# EAGLE design FANET_RPiZero (EAGLE 7.7.0)
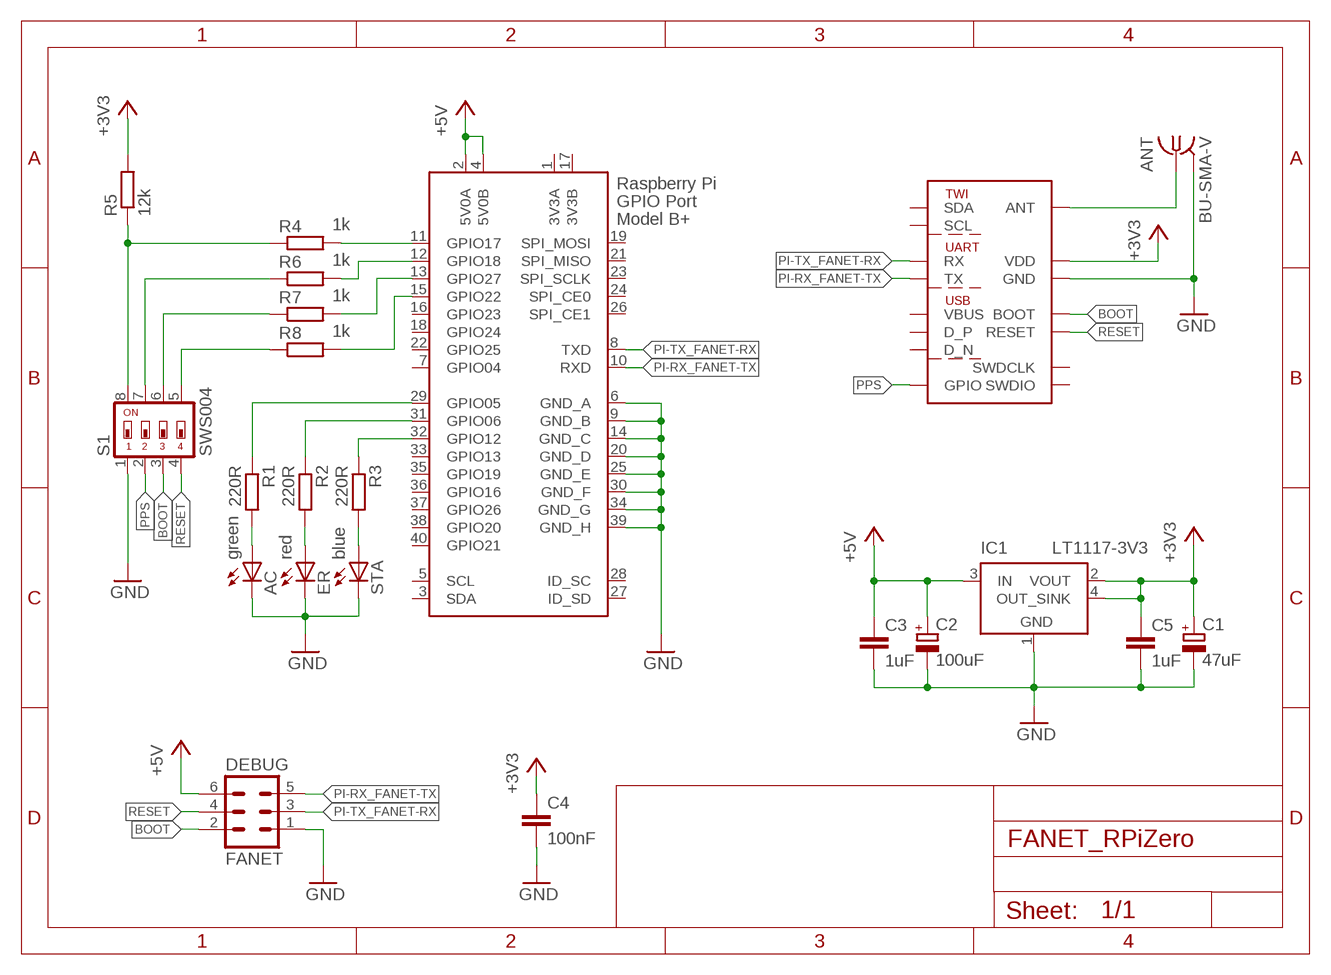
[diagram p0: schematic, sheet 1]

## Parts
AC  green  LEDCHIP-LED0805  [CHIP-LED0805]
ANT  BU-SMA-V  [BU-SMA-V]
C1  47uF  CPOL-EUSMCC  [SMC_C]
C2  100uF  CPOL-EUSMCC  [SMC_C]
C3  1uF  C-EUC1206  [C1206]
C4  100nF  C-EUC1206  [C1206]
C5  1uF  C-EUC1206  [C1206]
DEBUG  FANET  ML6  [ML6]
ER  red  LEDCHIP-LED0805  [CHIP-LED0805]
FANET_MODULE  FANET_MODULE  [FANET_INTERNAL]
IC1  LT1117-3V3  LT1117  [SOT223]
R1  220R  R-EU_R0805  [R0805]
R2  220R  R-EU_R0805  [R0805]
R3  220R  R-EU_R0805  [R0805]
R4  1k  R-EU_R0805  [R0805]
R5  12k  R-EU_R0805  [R0805]
R6  1k  R-EU_R0805  [R0805]
R7  1k  R-EU_R0805  [R0805]
R8  1k  R-EU_R0805  [R0805]
RASPI_ZERO  RASPI_GPIO_B+#  [RASPI_BOARD_ZERO_FULL_PAD]
S1  SWS004  [SMS-004]
STA  blue  LEDCHIP-LED0805  [CHIP-LED0805]

## Nets
+3V3: C1.+ C4.1 C5.1 FANET_MODULE.VSS(VDD) IC1.2(VOUT) IC1.4(OUT_SINK) R5.2
+5V: C2.+ C3.1 DEBUG.6 IC1.3(IN) RASPI_ZERO.2(5V0A) RASPI_ZERO.4(5V0B)
BOOT: DEBUG.2 FANET_MODULE.BOOT S1.3
GND: AC.C ANT.2 ANT.3 ANT.4 ANT.5 C1.- C2.- C3.2 C4.2 C5.2 DEBUG.1 ER.C FANET_MODULE.GND0(GND) FANET_MODULE.GND1(GND) IC1.1(GND) RASPI_ZERO.6(GND_A) RASPI_ZERO.9(GND_B) RASPI_ZERO.14(GND_C) RASPI_ZERO.20(GND_D) RASPI_ZERO.25(GND_E) RASPI_ZERO.30(GND_F) RASPI_ZERO.34(GND_G) RASPI_ZERO.39(GND_H) S1.1 STA.C
N$1: ANT.1 FANET_MODULE.ANT
N$2: R4.2 RASPI_ZERO.11(GPIO17)
N$4: R4.1 R5.1 S1.8
N$5: R6.1 S1.7
N$6: R6.2 RASPI_ZERO.12(GPIO18)
N$7: R7.2 RASPI_ZERO.13(GPIO27)
N$8: R8.2 RASPI_ZERO.15(GPIO22)
N$9: R7.1 S1.6
N$10: R8.1 S1.5
N$11: AC.A R1.2
N$12: ER.A R2.2
N$13: R3.2 STA.A
N$14: R3.1 RASPI_ZERO.32(GPIO12)
N$15: R2.1 RASPI_ZERO.31(GPIO06)
N$16: R1.1 RASPI_ZERO.29(GPIO05)
PI-RX_FANET-TX: DEBUG.5 FANET_MODULE.TX RASPI_ZERO.10(RXD)
PI-TX_FANET-RX: DEBUG.3 FANET_MODULE.RX RASPI_ZERO.8(TXD)
PPS: FANET_MODULE.GPIO0(GPIO) S1.2
RESET: DEBUG.4 FANET_MODULE.RESET S1.4
Unconnected: FANET_MODULE.D_N FANET_MODULE.D_P FANET_MODULE.SCL FANET_MODULE.SDA FANET_MODULE.SWDCLK FANET_MODULE.SWDIO FANET_MODULE.VBUS RASPI_ZERO.3(SDA) RASPI_ZERO.5(SCL) RASPI_ZERO.7(GPIO04) RASPI_ZERO.16(GPIO23) RASPI_ZERO.18(GPIO24) RASPI_ZERO.19(SPI_MOSI) RASPI_ZERO.21(SPI_MISO) RASPI_ZERO.22(GPIO25) RASPI_ZERO.23(SPI_SCLK) RASPI_ZERO.24(SPI_CE0) RASPI_ZERO.26(SPI_CE1) RASPI_ZERO.27(ID_SD) RASPI_ZERO.28(ID_SC) RASPI_ZERO.33(GPIO13) RASPI_ZERO.35(GPIO19) RASPI_ZERO.36(GPIO16) RASPI_ZERO.37(GPIO26) RASPI_ZERO.38(GPIO20) RASPI_ZERO.40(GPIO21)

## Power pins joined to a net without a drawn wire
3V3A: RASPI_ZERO.1(3V3A)
3V3B: RASPI_ZERO.17(3V3B)

## Library data of the parts
AC ER STA = led:LED: LED OSRAM: - CHIPLED LG R971, LG N971, LY N971, LG Q971, LY Q971, LO R971, LY R971 LH N974, LH R974 LS Q976, LO Q976, LY Q976 LO Q996 - Hyper CHIPLED LW Q18S LB Q993, LB Q99A, LB R99A - SideLED LS A670, LO A670, LY A670, LG A670, LP A670 LB A673, LV A673, LT A673, LW A673 LH A674 LY A675 LS A676, LA A676, LO A676, LY A676, LW A676 LS A679, LY A679, LG A679 - Hyper Micro SIDELED® LS Y876, LA Y876, LO Y876, LY Y876 LT Y87S - SmartLED LW L88C, LW L88S LB L89C, LB L89S, LG L890 LS L89K, LO L89K, LY L89K LS L896, LA L896, LO L896, LY L896 - TOPLED LS T670, LO T670, LY T670, LG T670, LP T670 LSG T670, LSP T670, LSY T670, LOP T670, LYG T670 LG T671, LOG T671, LSG T671 LB T673, LV T673, LT T673, LW T673 LH T674 LS T676, LA T676, LO T676, LY T676, LB T676, LH T676, LSB T676, LW T676 LB T67C, LV T67C, LT T67C, LS T67K, LO T67K, LY T67K, LW E67C LS E67B, LA E67B, LO E67B, LY E67B, LB E67C, LV E67C, LT E67C LW T67C LS T679, LY T679, LG T679 LS T770, LO T770, LY T770, LG T770, LP T770 LB T773, LV T773, LT T773, LW T773 LH T774 LS E675, LA E675, LY E675, LS T675 LS T776, LA T776, LO T776, LY T776, LB T776 LHGB T686 LT T68C, LB T68C - Hyper Mini TOPLED® LB M676 - Mini TOPLED Santana® LG M470 LS M47K, LO M47K, LY M47K Source: http://www.osram.convergy.de LUXEON: - LUMILED® LXK2-PW12-R00, LXK2-PW12-S00, LXK2-PW14-U00, LXK2-PW14-V00 LXK2-PM12-R00, LXK2-PM12-S00, LXK2-PM14-U00 LXK2-PE12-Q00, LXK2-PE12-R00, LXK2-PE12-S00, LXK2-PE14-T00, LXK2-PE14-U00 LXK2-PB12-K00, LXK2-PB12-L00, LXK2-PB12-M00, LXK2-PB14-N00, LXK2-PB14-P00, LXK2-PB14-Q00 LXK2-PR12-L00, LXK2-PR12-M00, LXK2-PR14-Q00, LXK2-PR14-R00 LXK2-PD12-Q00, LXK2-PD12-R00, LXK2-PD12-S00 LXK2-PH12-R00, LXK2-PH12-S00 LXK2-PL12-P00, LXK2-PL12-Q00, LXK2-PL12-R00 Source: www.luxeon.com KINGBRIGHT: KA-3528ASYC Source: www.kingbright.com
ANT = con-coax:BU-SMA-V: FEMALE SMA CONNECTOR Radiall distributor RS 112-3794; OC_FARNELL: unknown; OC_NEWARK: unknown
C1 C2 = rcl:CPOL-EU: POLARIZED CAPACITOR, European symbol
C3-C5 = rcl:C-EU: CAPACITOR, European symbol
DEBUG = con-harting-ml:ML6: HARTING; OC_FARNELL: unknown; OC_NEWARK: unknown
FANET_MODULE = fanet:FANET_MODULE
IC1 = mylib:LT1117: VOLTAGE REGULATOR with shutdown; MPN: LT1117
R1-R8 = rcl:R-EU_: RESISTOR, European symbol
RASPI_ZERO = raspberrypi_b+_zero:RASPI_GPIO_B+#: 2x20 header connector, all pins connected
S1 = smd-special:SWS004: SMD Dip Switch 4 pol.

## Board
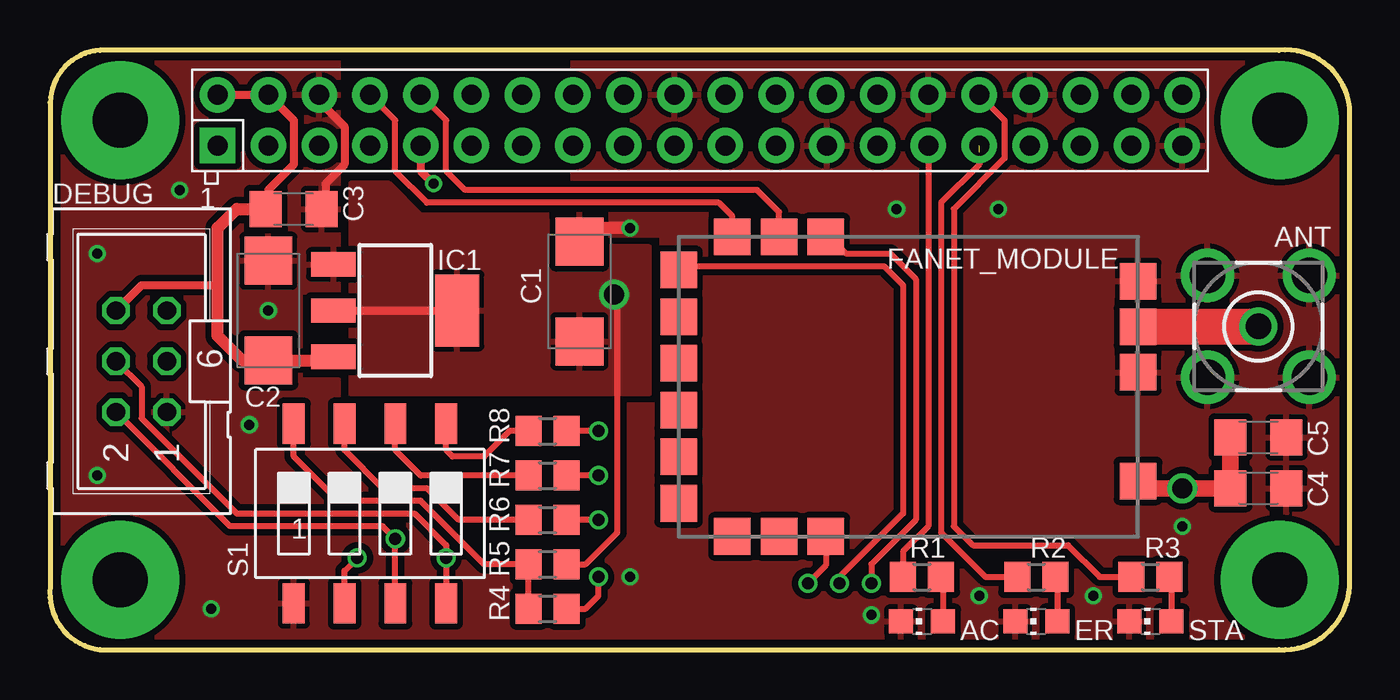
[diagram p1: board, top side]
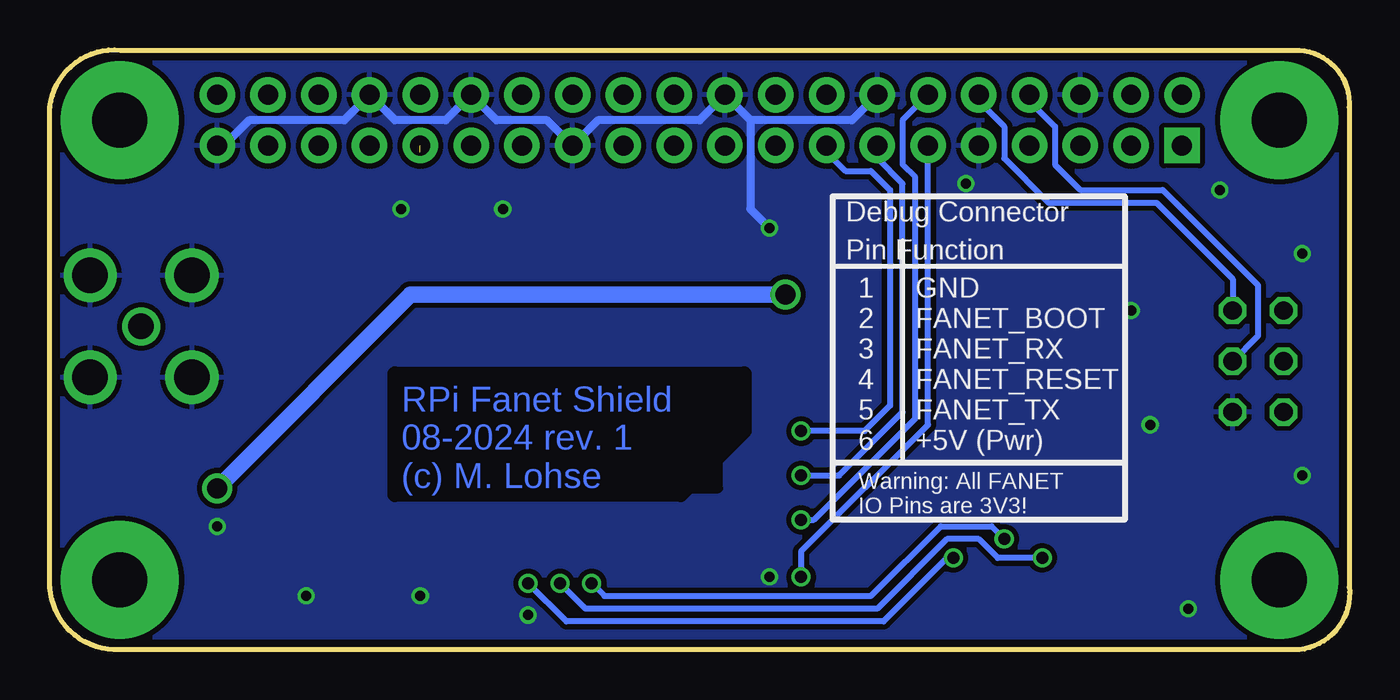
[diagram p2: board, bottom side, seen from below]

Size 65.02 x 30.02 mm. Coordinates in mm from the lower left corner, seen from the top.
Copper layers (1*16): Top 0.0356mm / dielectric 1.5011mm / Bottom 0.0356mm
Design rules "LaenPCBOrder": minimum track width 6mil, minimum drill 13mil, track to track 6mil, track to pad 6mil, pad to pad 6mil, via to via 6mil, smd to smd 6mil, copper to edge 15mil, drill to drill 6mil, minimum pad ring 7mil, minimum via ring 7mil, stop-mask expansion 3mil, vias tented up to drill 0mil, thermal gap 10mil
bRestrict: 5 lines

### Footprints (pad centres in the part's own frame; a part is rotated, then mirrored left to right if it is on the bottom)
CHIP-LED0805 = smd 1.2 x 1.2: A 0,-1.05; C 0,1.05
BU-SMA-V = drill 1.27: 1 0,0 | drill 1.778: 2 -2.55,2.55; 3 2.55,2.55; 4 2.55,-2.55; 5 -2.55,-2.55
SMC_C = smd 2.4 x 2.4: + -2.5,0; - 2.5,0
C1206 = smd 1.6 x 1.8: 1 -1.4,0; 2 1.4,0
ML6 = drill 0.914 octagon: 1 -2.54,-1.27; 2 -2.54,1.27; 3 0,-1.27; 4 0,1.27; 5 2.54,-1.27; 6 2.54,1.27
FANET_INTERNAL = smd 1.829 x 1.829: ANT -2.997,14.3; BOOT 7.493,-1.321; D_N -3.505,-8.687; D_P -1.168,-8.687; GND0 -5.283,14.3; GND1 -0.711,14.3; GPIO0 -5.842,-8.687; RESET -7.493,-1.321; RX -7.493,-5.994; SCL 7.493,-5.994; SDA 7.493,-3.658; SWDCLK 3.505,-8.687; SWDIO 1.168,-8.687; TX -7.493,-3.658; VBUS 5.842,-8.687; VSS 4.724,14.3
SOT223 = smd 1.219 x 2.235: 1 -2.311,-3.099; 2 0,-3.099; 3 2.311,-3.099 | smd 3.6 x 2.2: 4 0,3.099
R0805 = smd 1.3 x 1.5: 1 -0.95,0; 2 0.95,0
RASPI_BOARD_ZERO_FULL_PAD = drill 1 pad 1.778 square: 1 8.89,25.4 | drill 1 pad 1.778: 2 8.89,27.94; 3 11.43,25.4; 4 11.43,27.94; 5 13.97,25.4; 6 13.97,27.94; 7 16.51,25.4; 8 16.51,27.94; 9 19.05,25.4; 10 19.05,27.94; 11 21.59,25.4; 12 21.59,27.94; 13 24.13,25.4; 14 24.13,27.94; 15 26.67,25.4; 16 26.67,27.94; 17 29.21,25.4; 18 29.21,27.94; 19 31.75,25.4; 20 31.75,27.94; 21 34.29,25.4; 22 34.29,27.94; 23 36.83,25.4; 24 36.83,27.94; 25 39.37,25.4; 26 39.37,27.94; 27 41.91,25.4; 28 41.91,27.94; 29 44.45,25.4; 30 44.45,27.94; 31 46.99,25.4; 32 46.99,27.94; 33 49.53,25.4; 34 49.53,27.94; 35 52.07,25.4; 36 52.07,27.94; 37 54.61,25.4; 38 54.61,27.94; 39 57.15,25.4; 40 57.15,27.94 | drill 2.75 pad 5.9: DRILL_1 4.02,26.67; DRILL_2 62.02,26.67; DRILL_3 4.02,3.67; DRILL_4 62.02,3.67
SMS-004 = smd 1.092 x 2.007: 1 -3.81,-4.496; 2 -1.27,-4.496; 3 1.27,-4.496; 4 3.81,-4.496; 5 3.81,4.496; 6 1.27,4.496; 7 -1.27,4.496; 8 -3.81,4.496

### Placement (x,y rotation side)
AC  43.63,1.42 90 top
ANT  60.46,16.18 270 top
C1  26.49,17.93 90 top
C2  10.93,16.98 90 top
C3  12.2,22.06 0 top
C4  60.46,8.09 0 top
C5  60.46,10.63 0 top
DEBUG  4.58,14.44 90 top
ER  49.35,1.42 90 top
FANET_MODULE  40.14,13.17 270 top
IC1  17.28,16.98 270 top
R1  43.63,3.64 0 top
R2  49.35,3.64 0 top
R3  55.06,3.64 0 top
R4  24.9,2.06 0 top
R5  24.9,4.28 0 top
R6  24.9,6.5 0 top
R7  24.9,8.72 0 top
R8  24.9,10.95 0 top
RASPI_ZERO  -0.5,-0.17 0 top
S1  16.01,6.82 0 top
STA  55.06,1.42 90 top

### Tracks (layer width: path | path; a pad name or v marks a point on that pad's centre or on a via)
+3V3  (via drill 1)
  Top 0.305: R5.2 26.8,4.28 28.39,5.87 28.39,17.61 v28.23,17.77 | 25.89,15.39 C1.+
  Top 0.406: IC1.2 IC1.4
  Top 0.813: C5.1 C4.1 v56.65,8.09 54.79,8.09 FANET_MODULE.VSS
  Bottom 0.813: v28.23,17.77 46.96,17.77 v56.65,8.09
  pour Top (isolate 0.305): 15.06,23.33 15.06,12.85 29.98,12.85 29.98,20.15 25.53,20.15 25.53,21.74 18.55,21.74 16.96,23.33
+5V
  Top 0.305: 10.93,22.19 C3.1
  Top 0.406: RASPI_ZERO.2 RASPI_ZERO.4 12.2,26.5 12.2,24.28 10.93,23.01 10.93,22.19 | DEBUG.6 4.58,18.25 8.39,18.25
  Top 0.61: C3.1 9.34,22.06 8.39,21.11 8.39,18.25 8.39,15.71 9.62,14.48 C2.+ 13.99,14.48 IC1.3
BOOT  (via drill 0.6)
  Top 0.305: S1.3 v17.28,5.55 16.64,6.18 9.02,6.18 DEBUG.2 | FANET_MODULE.BOOT 38.82,4.23 v37.92,3.33
  Bottom 0.305: v37.92,3.33 37.28,2.69 23.95,2.69 20.45,6.18 17.91,6.18 v17.28,5.55
GND  (via drill 0.5)
  Top 0.406: RASPI_ZERO.6 13.47,27.46 14.74,26.19 14.74,24.28 13.79,23.33 13.79,22.25 C3.2 | 27.16,21.11 C1.- | RASPI_ZERO.9 18.55,23.96 v19.18,23.33
  Top 0.61: v29.03,21.11 27.16,21.11
  Bottom 0.406: RASPI_ZERO.14 24.9,26.5 29.98,26.5 | 29.98,26.5 RASPI_ZERO.20 32.52,26.5 37.6,26.5 RASPI_ZERO.25 40.14,26.5 42.68,26.5 RASPI_ZERO.30 45.22,26.5 47.76,26.5 RASPI_ZERO.34 50.3,26.5 55.06,26.5 56.33,25.23 RASPI_ZERO.39 | 29.98,26.5 29.98,22.06 v29.03,21.11
  other vias: 10.93,16.98 41.09,1.74 46.49,2.69 52.2,2.69 56.65,6.18 47.44,22.06 42.36,22.06 8.07,2.06 2.36,19.84 2.36,8.72 6.48,23.01 9.98,11.26 29.03,3.64
  pour Bottom (isolate 0.254): 0.13,27.14 0.13,3.01 2.99,0.15 61.41,0.15 64.9,3.64 64.9,26.82 61.73,30 2.99,30
  pour Top (isolate 0.305): 26.17,30 26.17,21.11 26.17,20.79 30.61,20.79 30.61,12.53 30.61,12.22 14.42,12.22 14.42,13.49 12.52,13.49 12.52,17.93 14.42,17.93 14.42,30 2.99,30 0.13,27.14 0.13,3.01 2.99,0.15 61.41,0.15 64.9,3.64 64.9,27.14 62.05,30
N$1
  Top 1.778: FANET_MODULE.ANT 54.46,16.18
  Top 1.8: 54.46,16.18 ANT.1
N$2  (via drill 0.6)
  Top 0.305: R4.2 26.8,2.06 27.44,2.69 v27.44,3.64
  Bottom 0.305: RASPI_ZERO.11 21.09,11.26 27.44,4.91 v27.44,3.64
N$4
  Top 0.305: S1.8 12.2,9.68 14.42,7.45 18.55,7.45 21.72,4.28 R5.1 R4.1
N$5
  Top 0.305: R6.1 20.45,6.5 18.87,8.09 16.64,8.09 14.74,9.99 S1.7
N$6  (via drill 0.6)
  Top 0.305: v27.44,6.5 R6.2
  Bottom 0.305: RASPI_ZERO.12 22.36,26.5 22.36,24.28 21.72,23.65 21.72,11.58 26.8,6.5 v27.44,6.5
N$7  (via drill 0.6)
  Top 0.305: v27.44,8.72 R7.2
  Bottom 0.305: RASPI_ZERO.13 23.63,24.6 22.36,23.33 22.36,11.9 25.53,8.72 v27.44,8.72
N$8  (via drill 0.6)
  Top 0.305: v27.44,10.95 R8.2
  Bottom 0.305: RASPI_ZERO.15 26.17,24.92 25.22,23.96 23.95,23.96 22.99,23.01 22.99,12.22 24.26,10.95 v27.44,10.95
N$9
  Top 0.305: R7.1 18.55,8.72 17.28,9.99 S1.6
N$10
  Top 0.305: S1.5 20.19,10.95 19.82,10.58 19.82,9.99 20.14,9.68 21.72,9.68 22.99,10.95 R8.1
N$11
  Top 0.305: R1.2 44.68,3.54 AC.A
N$12
  Top 0.305: R2.2 50.4,3.23 ER.A
N$13
  Top 0.305: R3.2 56.11,3.23 STA.A
N$14
  Top 0.305: 53.47,3.65 R3.1 52.52,3.64 50.93,5.23 46.17,5.23 45.22,6.18 45.22,22.06 47.76,24.6 47.76,26.5 RASPI_ZERO.32
N$15  (1 unrouted)
  Top 0.305: 46.49,24.92 46.49,24.28 44.58,22.38 44.58,5.87 46.81,3.64 R2.1 48.08,3.65
N$16
  Top 0.305: RASPI_ZERO.29 43.95,6.18 42.68,4.91 R1.1
PI-RX_FANET-TX
  Top 0.305: FANET_MODULE.TX 36.48,21.91 35.38,23.01 20.77,23.01 19.82,23.96 19.82,26.5 RASPI_ZERO.10
  Bottom 0.305: RASPI_ZERO.10 18.55,27.46 17.28,26.19 17.28,24.6 15.06,22.38 9.66,22.38 5.85,18.57 DEBUG.5
PI-TX_FANET-RX
  Top 0.305: FANET_MODULE.RX 34.14,21.7 33.47,22.38 18.87,22.38 17.28,23.96 17.28,26.5 RASPI_ZERO.8
  Bottom 0.305: RASPI_ZERO.8 16.01,27.46 14.74,26.19 14.74,24.28 13.47,23.01 9.34,23.01 4.58,18.25 4.58,15.71 DEBUG.3
PPS  (via drill 0.6)
  Top 0.305: S1.2 14.74,3.96 v15.37,4.6 | FANET_MODULE.GPIO0 31.58,18.88 31.88,18.88 32.2,19.2 41.73,19.2 42.68,18.25 42.68,6.82 39.5,3.64 v39.5,3.33
  Bottom 0.305: v39.5,3.33 38.23,2.06 23.63,2.06 20.14,5.55 18.55,5.55 17.6,4.6 v15.37,4.6
RESET  (via drill 0.6)
  Top 0.305: DEBUG.4 4.58,13.17 4.58,11.58 9.34,6.82 18.23,6.82 19.82,5.23 v19.82,4.6 S1.4 | 38.87,20.71 FANET_MODULE.RESET 39,20.66 39.82,19.84 42.04,19.84 43.31,18.57 43.31,6.5 41.09,4.28 v41.09,3.33
  Bottom 0.305: v19.82,4.6 20.14,4.6 23.31,1.42 39.19,1.42 v41.09,3.33

### Text on the board
Bottom: RPi Fanet Shield / 08-2024 rev. 1 / (c) M. Lohse
bNames: Debug Connector | Pin Function | GND / FANET_BOOT / FANET_RX / FANET_RESET / FANET_TX / +5V (Pwr) | 1 / 2 / 3 / 4 / 5 / 6 | Warning: All FANET / IO Pins are 3V3!
bStop: RPi Fanet Shield / 08-2024 rev. 1 / (c) M. Lohse